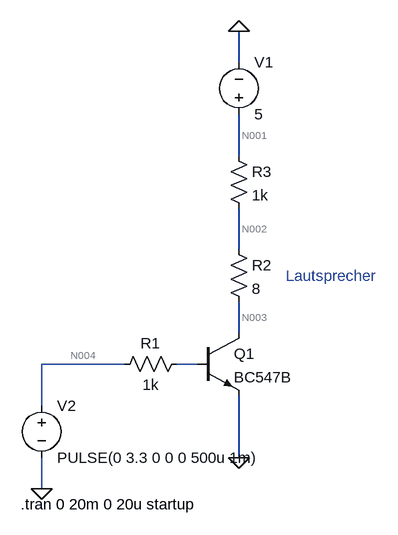
[diagram p0: schematic c64_tap_pulse_to_audio.asc]
c64_tap_pulse_to_audio.asc, the LTspice schematic file:
Version 4
SHEET 1 880 680
WIRE 320 -256 320 -304
WIRE 320 -112 320 -176
WIRE 320 32 320 -32
WIRE 320 160 320 112
WIRE 144 208 16 208
WIRE 256 208 224 208
WIRE 16 272 16 208
WIRE 320 352 320 256
WIRE 16 400 16 352
FLAG 320 352 0
FLAG 320 -304 0
FLAG 16 400 0
SYMBOL res 240 192 R90
WINDOW 0 0 56 VBottom 2
WINDOW 3 32 56 VTop 2
SYMATTR InstName R1
SYMATTR Value 1k
SYMBOL npn 256 160 R0
SYMATTR InstName Q1
SYMATTR Value BC547B
SYMBOL res 304 16 R0
SYMATTR InstName R2
SYMATTR Value 8
SYMBOL voltage 320 -160 M180
WINDOW 0 24 96 Left 2
WINDOW 3 24 16 Left 2
WINDOW 123 0 0 Left 0
WINDOW 39 0 0 Left 0
SYMATTR InstName V1
SYMATTR Value 5
SYMBOL voltage 16 256 R0
WINDOW 123 0 0 Left 0
WINDOW 39 0 0 Left 0
SYMATTR InstName V2
SYMATTR Value PULSE(0 3.3 0 0 0 500u 1m)
SYMBOL res 304 -128 R0
SYMATTR InstName R3
SYMATTR Value 1k
TEXT -16 424 Left 2 !.tran 0 20m 0 20u startup
TEXT 392 72 Left 2 ;Lautsprecher

The netlist it stands for:
* c64_tap_pulse_to_audio.asc
R1 N005 N004 1k
Q1 N003 N005 0 0 BC547B
R2 N002 N003 8
V1 N001 0 5
V2 N004 0 PULSE(0 3.3 0 0 0 500u 1m)
R3 N001 N002 1k
.model NPN NPN
.model PNP PNP
.lib standard.bjt
.tran 0 20m 0 20u startup
* Lautsprecher
.backanno
.end

* Results of the author's LTspice run, read from the files saved beside the schematic
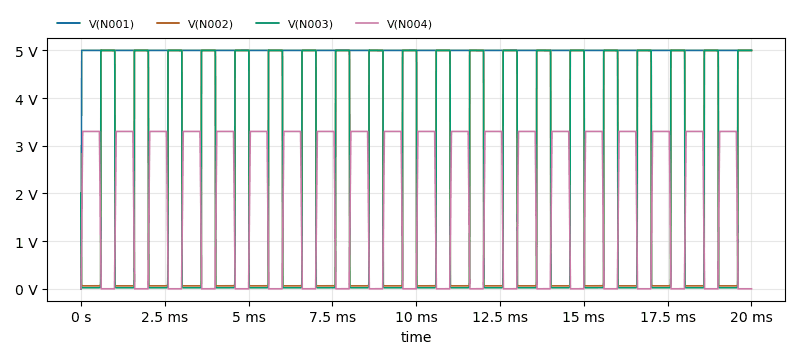
[diagram p1: Transient Analysis of c64_tap_pulse_to_audio.asc, plotted from the saved traces]
* Transient Analysis, 1 run:
*   V(N001): min 0 V, max 5 V, average 4.998 V, rms 4.998 V, last 5 V
*   V(N002): min 0 V, max 5.001 V, average 2.135 V, rms 3.237 V, last 5 V
*   V(N003): min 0 V, max 5.001 V, average 2.112 V, rms 3.236 V, last 5 V
*   V(N004): min 0 V, max 3.3 V, average 1.815 V, rms 2.411 V, last 0 V